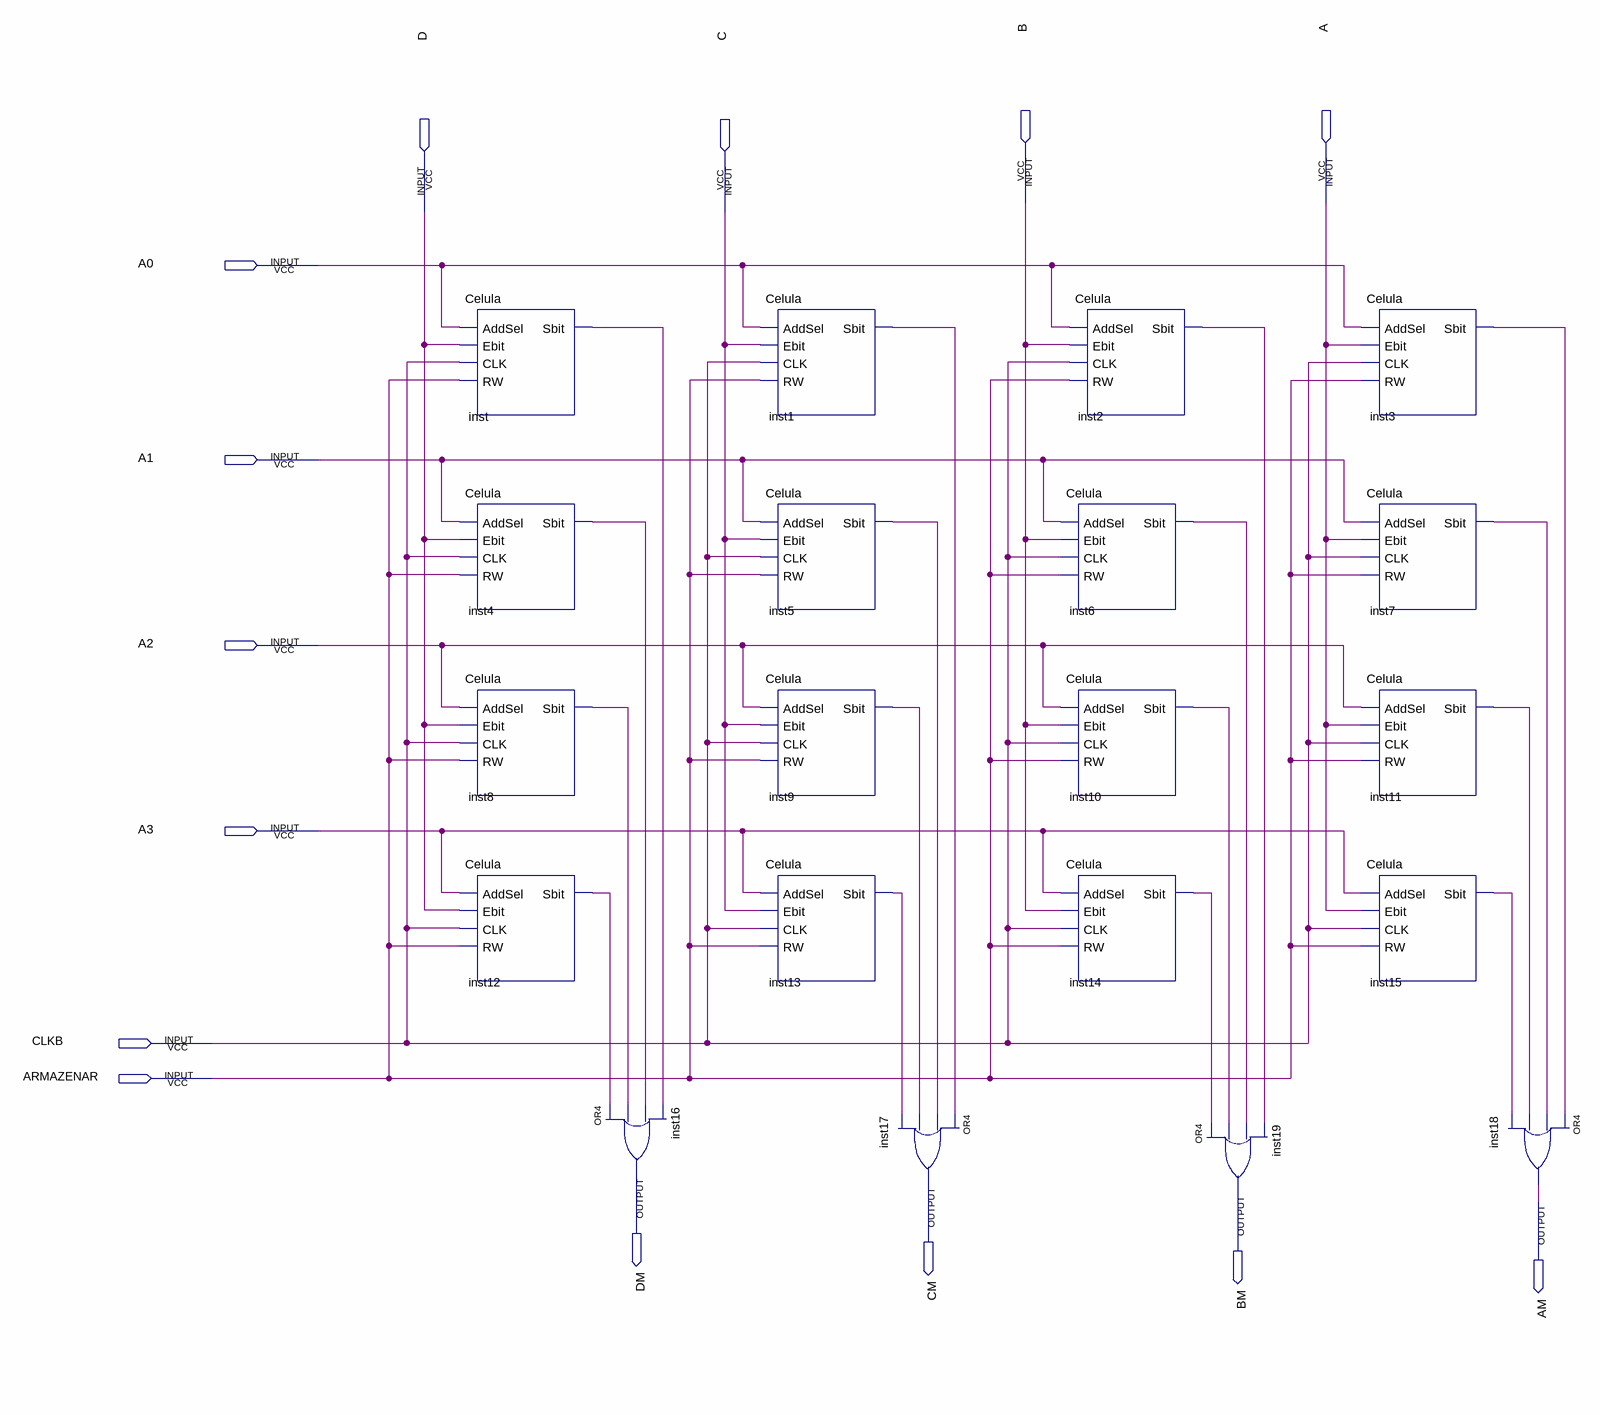
[diagram p0: schematic sheet]
// Quartus schematic Memoria.bdf as structural Verilog: 20 symbols, 14 pins
module Memoria (
  input  B,
  input  A,
  input  D,
  input  C,
  input  A0,
  input  A1,
  input  A2,
  input  A3,
  input  CLKB,
  input  ARMAZENAR,
  output DM,
  output CM,
  output BM,
  output AM
);

  wire inst1_sbit, inst2_sbit, inst3_sbit, inst4_sbit, inst5_sbit, inst6_sbit, inst7_sbit, inst8_sbit,
       inst9_sbit, inst10_sbit, inst11_sbit, inst12_sbit, inst13_sbit, inst14_sbit, inst15_sbit, inst_sbit;

  Celula inst (.AddSel(A0), .Ebit(D), .CLK(CLKB), .RW(ARMAZENAR), .Sbit(inst_sbit));
  Celula inst4 (.AddSel(A1), .Ebit(D), .CLK(CLKB), .RW(ARMAZENAR), .Sbit(inst4_sbit));
  Celula inst8 (.AddSel(A2), .Ebit(D), .CLK(CLKB), .RW(ARMAZENAR), .Sbit(inst8_sbit));
  Celula inst12 (.AddSel(A3), .Ebit(D), .CLK(CLKB), .RW(ARMAZENAR), .Sbit(inst12_sbit));
  or inst16 (DM, inst12_sbit, inst8_sbit, inst4_sbit, inst_sbit);
  Celula inst1 (.AddSel(A0), .Ebit(C), .CLK(CLKB), .RW(ARMAZENAR), .Sbit(inst1_sbit));
  Celula inst5 (.AddSel(A1), .Ebit(C), .CLK(CLKB), .RW(ARMAZENAR), .Sbit(inst5_sbit));
  Celula inst9 (.AddSel(A2), .Ebit(C), .CLK(CLKB), .RW(ARMAZENAR), .Sbit(inst9_sbit));
  Celula inst13 (.AddSel(A3), .Ebit(C), .CLK(CLKB), .RW(ARMAZENAR), .Sbit(inst13_sbit));
  or inst17 (CM, inst1_sbit, inst5_sbit, inst9_sbit, inst13_sbit);
  Celula inst2 (.AddSel(A0), .Ebit(B), .CLK(CLKB), .RW(ARMAZENAR), .Sbit(inst2_sbit));
  Celula inst6 (.AddSel(A1), .Ebit(B), .CLK(CLKB), .RW(ARMAZENAR), .Sbit(inst6_sbit));
  Celula inst10 (.AddSel(A2), .Ebit(B), .CLK(CLKB), .RW(ARMAZENAR), .Sbit(inst10_sbit));
  Celula inst14 (.AddSel(A3), .Ebit(B), .CLK(CLKB), .RW(ARMAZENAR), .Sbit(inst14_sbit));
  or inst19 (BM, inst14_sbit, inst10_sbit, inst6_sbit, inst2_sbit);
  Celula inst3 (.AddSel(A0), .Ebit(A), .CLK(CLKB), .RW(ARMAZENAR), .Sbit(inst3_sbit));
  Celula inst7 (.AddSel(A1), .Ebit(A), .CLK(CLKB), .RW(ARMAZENAR), .Sbit(inst7_sbit));
  Celula inst11 (.AddSel(A2), .Ebit(A), .CLK(CLKB), .RW(ARMAZENAR), .Sbit(inst11_sbit));
  Celula inst15 (.AddSel(A3), .Ebit(A), .CLK(CLKB), .RW(ARMAZENAR), .Sbit(inst15_sbit));
  or inst18 (AM, inst3_sbit, inst7_sbit, inst11_sbit, inst15_sbit);
endmodule
